# Altium schematic sheet Sheet1.SchDoc
size A4; SheetNumber: 1; SheetTotal: 1
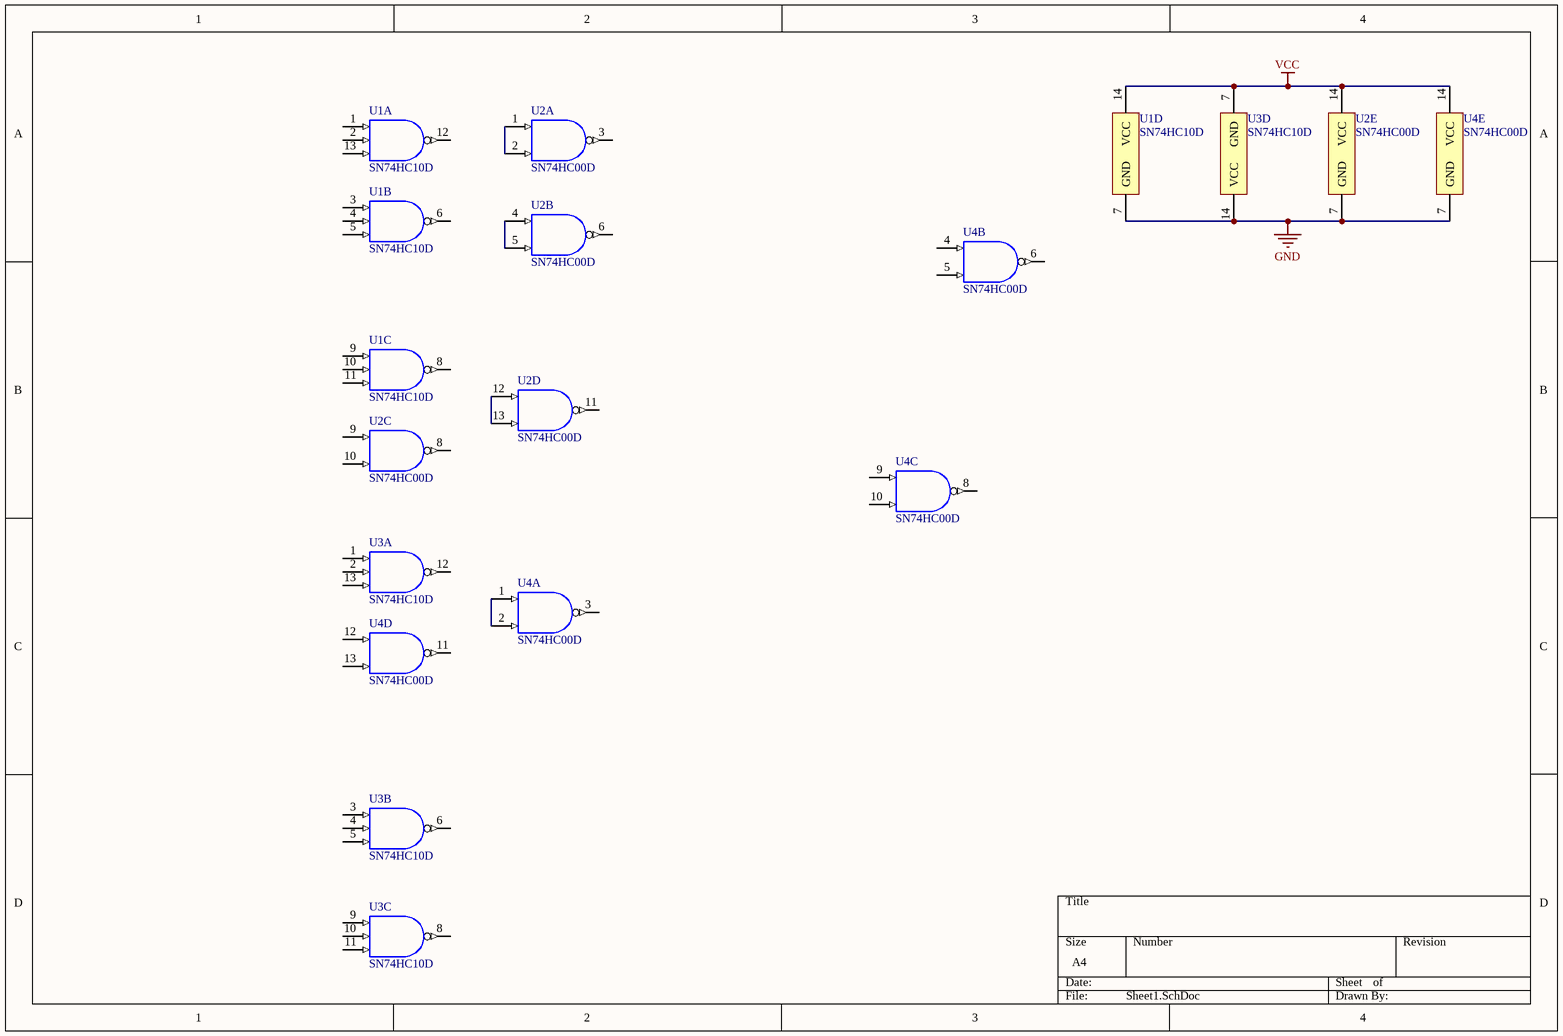
[diagram p0: Sheet1.SchDoc]

## Parts
U1  SN74HC10D  [D0014A_M]  (parts A,B,C,D of 4)
U2  SN74HC00D  [D0014A_L]  (parts A,B,C,D,E of 5)
U3  SN74HC10D  [D0014A_M]  (parts A,B,C,D of 4)
U4  SN74HC00D  [D0014A_L]  (parts A,B,C,D,E of 5)

## Nets
GND: U1.7(GND) U2.7(GND) U3.14(VCC) U4.7(GND)
VCC: U1.14(VCC) U2.14(VCC) U3.7(GND) U4.14(VCC)
NetU2_1: U2.1(1A) U2.2(1B)
NetU2_4: U2.4(2A) U2.5(2B)
NetU2_12: U2.12(4A) U2.13(4B)
NetU4_1: U4.1(1A) U4.2(1B)

Not connected (* = marked no-connect by the designer): U1 1(1A) 2(1B) 3(2A) 4(2B) 5(2C) 6(2Y) 8(3Y) 9(3A) 10(3B) 11(3C) 12(1Y) 13(1C); U2 3(1Y) 6(2Y) 8(3Y) 9(3A) 10(3B) 11(4Y); U3 1(1A) 2(1B) 3(2A) 4(2B) 5(2C) 6(2Y) 8(3Y) 9(3A) 10(3B) 11(3C) 12(1Y) 13(1C); U4 3(1Y) 4(2A) 5(2B) 6(2Y) 8(3Y) 9(3A) 10(3B) 11(4Y) 12(4A) 13(4B)

## Library data of the parts
U1 U3 = CMP-1627-00162-2: Triple 3-Input Positive-NAND Gates, D0014A, TUBE; Manufacturer: Texas Instruments; Schmitt Trigger: No; Technology Family: HC; tpd @ Nom Voltage(Max)(ns): 24; Bits(#): 3; VCC(Min)(V): 2; Output Drive (IOL/IOH)(Max)(mA): 5.2/-5.2; Output Type: CMOS; Voltage(Nom)(V): 5; Rating: Catalog; ICC @ Nom Voltage(Max)(mA): 0.02; F @ Nom Voltage(Max)(Mhz): 70; VCC(Max)(V): 6; Operating Temperature Range(C): -40 to 85; PackageReference: D0014A; Input Type: CMOS; Generic Part Number: SN74HC10; DatasheetVersion: SCLS083D; Code_JEDEC: MS-012
U2 U4 = CMP-1627-00173-2: Quad 2-Input Positive-NAND Gates, D0014A, TUBE; Manufacturer: Texas Instruments; tpd @ Nom Voltage(Max)(ns): 23; Rating: Catalog; F @ Nom Voltage(Max)(Mhz): 70; Input Type: CMOS; VCC(Min)(V): 2; VCC(Max)(V): 6; Technology Family: HC; Voltage(Nom)(V): 5; Schmitt Trigger: Yes; ICC @ Nom Voltage(Max)(mA): 0.02; Output Drive (IOL/IOH)(Max)(mA): 5.2/-5.2; Bits(#): 4; PackageReference: D0014A; DatasheetVersion: SCLS181E; Output Type: CMOS; Generic Part Number: SN74HC00; Code_JEDEC: MS-012; Operating Temperature Range(C): -40 to 85